# Altium schematic sheet Microcontroller.SchDoc
size A4; SheetNumber: 5; SheetTotal: 5
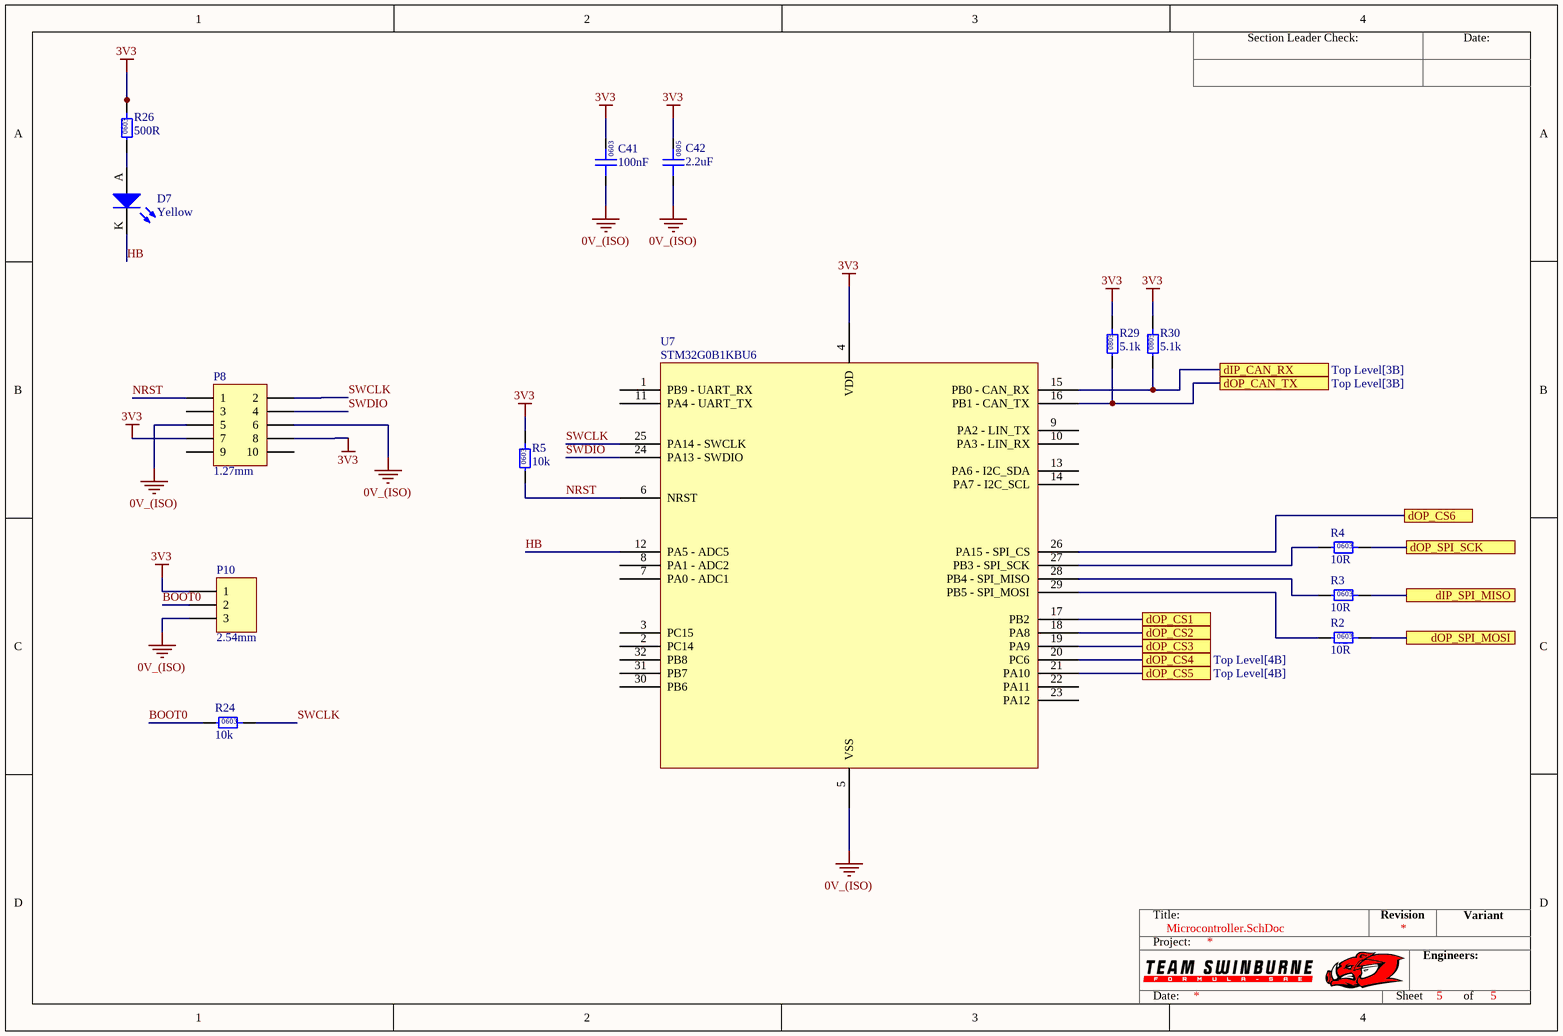
[diagram p0: Microcontroller.SchDoc]

## Parts
C41  100nF  [0603 Capacitor]
C42  2.2uF  [GCM21BR71H105KA03L-Footprint-1]
D7  Yellow  [0805 LED]
P8  1.27mm  [3221-10-0300-00]
P10  2.54mm  [TH 2.54mm Header 1x3]
R2  10R  [0603]
R3  10R  [0603]
R4  10R  [0603]
R5  10k  [0603]
R24  10k  [0603]
R26  500R  [0603]
R29  5.1k  [0805]
R30  5.1k  [0805]
U7  STM32G0B1KBU6  [ST-UFQFPN32]

## Ports
dIP_CAN_RX (see Top Level[3B]), dIP_SPI_MISO (see Top Level[4C], Temp Bank[1C]), dOP_CAN_TX (see Top Level[3B]), dOP_CS1 (see Top Level[4B]), dOP_CS2 (see Top Level[4B]), dOP_CS3 (see Top Level[4B]), dOP_CS4 (see Top Level[4B]), dOP_CS5 (see Top Level[4B]), dOP_CS6 (see Top Level[4B]), dOP_SPI_MOSI (see Top Level[4B], Temp Bank[1C]), dOP_SPI_SCK (see Top Level[4B])

## Nets
0V_(ISO): C41.1 C42.1 P8.5 P8.6 P10.3 U7.5(VSS)
3V3: C41.2 C42.2 P8.7 P8.8 P10.1 R5.2 R26.2 R29.2 R30.2 U7.4(VDD)
BOOT0: P10.2 R24.1
dIP_CAN_RX: R30.1 U7.15(PB0_-_CAN_RX) ; port dIP_CAN_RX
dIP_SPI_MISO: R3.2 ; port dIP_SPI_MISO
dOP_CAN_TX: R29.1 U7.16(PB1_-_CAN_TX) ; port dOP_CAN_TX
dOP_CS1: U7.17(PB2) ; port dOP_CS1
dOP_CS2: U7.18(PA8) ; port dOP_CS2
dOP_CS3: U7.19(PA9) ; port dOP_CS3
dOP_CS4: U7.20(PC6) ; port dOP_CS4
dOP_CS5: U7.21(PA10) ; port dOP_CS5
dOP_CS6: U7.26(PA15_-_SPI_CS) ; port dOP_CS6
dOP_SPI_MOSI: R2.2 ; port dOP_SPI_MOSI
dOP_SPI_SCK: R4.2 ; port dOP_SPI_SCK
HB: D7.K U7.12(PA5_-_ADC5)
NRST: P8.1 R5.1 U7.6(NRST)
SWCLK: P8.2 R24.2 U7.25(PA14_-_SWCLK)
SWDIO: P8.4 U7.24(PA13_-_SWDIO)
NetD7_A: D7.A R26.1
NetR2_1: R2.1 U7.29(PB5_-_SPI_MOSI)
NetR3_1: R3.1 U7.28(PB4_-_SPI_MISO)
NetR4_1: R4.1 U7.27(PB3_-_SPI_SCK)

Not connected (* = marked no-connect by the designer): P8 3 9 10; U7 1(PB9_-_UART_RX) 2(PC14) 3(PC15) 7(PA0_-_ADC1) 8(PA1_-_ADC2) 9(PA2_-_LIN_TX) 10(PA3_-_LIN_RX) 11(PA4_-_UART_TX) 13(PA6_-_I2C_SDA) 14(PA7_-_I2C_SCL) 22(PA11) 23(PA12) 30(PB6) 31(PB7) 32(PB8)

## Notes on the sheet
- Section Leader Check:
- Date:
- Title:
- Revision
- Variant
- Project:
- Engineers:
- Sheet
- of
- (in symbol CMP-102-000031-7) 0603
- (in symbol CMP-102-000032-2) 0805
- (in symbol RC0603FR-0710KL) 0603
- (in symbol RC0603FR-0710RL) 0603
- (in symbol RC0805FR075K1L) 0805
- (in symbol RT0603BRD07500RL) 0603

## Library data of the parts
C41 = CMP-102-000031-7: Ceramic Capacitor, Multilayer, Ceramic, 50V, 10% +Tol, 10% -Tol, X8L, -40/+15% TC, 0.1uF, Surface Mount, 0603; Part Number: GCM188L81H104KA57D; Material: X8L; Digikey Link: https://www.digikey.com.au/en/products/detail/murata-electronics/GCM188L81H104KA57D/2591908?s=N4IgTCBcDaIOIGECyBGAHGgMmlAJFADACwDSAggKwDsAIiALoC%2BQA; Rated Voltage: 50V; Tolerance: 10%; Value: 100nF
C42 = CMP-102-000032-2: Ceramic Capacitor, Multilayer, Ceramic, 25V, 10% +Tol, 10% -Tol, X7R, 15% TC, 2.2uF, Surface Mount, 0805; Part Number: GRM21BR71E225KE11L; Rated Voltage: 50V; Value: 2.2µF; Material: X7R; Tolerance: 10%; Digikey Link: https://www.digikey.com.au/en/products/detail/murata-electronics/GRM21BR71E225KE11L/6606096?s=N4IgTCBcDaIOICUCyYCMAhBB2VBRMYArANK6qoAyIAugL5A
D7 = SML-211YTT86: Yellow LED Indication - Discrete 1.75V 0805 (2012 Metric); Manufacturer: ROHM Semiconductor; Part Number: SML-211YTT86; Colour: Yellow; Digikey Part Number: 511-1293-1-ND
P8 = SMD 1.27mm Header 2x5 (3221-10-0300-00): Positions: 10; Angle: 0; Flange: No; Contact: NA; Part Number: SMD 1.27mm Header 2x5 (3221-10-0300-00); Pitch: 1.27mm; Row Spacing: 1.27mm
P10 = TH 2.54mm Header 1x3: Positions: 3; Angle: 0; Flange: No; Contact: NA; Part Number: TH 2.54mm Header 1x3; Pitch: 2.54mm; Row Spacing: 2.54mm
R2-R4 = RC0603FR-0710RL: Manufacturer: YAGEO; Tolerance: 0.01; Rated Power: 0.1W; Part Number: RC0603FR-0710RL; Value: 10R; Material: FR-07; Digikey Part Number: 311-10.0HRCT-ND
R5 R24 = RC0603FR-0710KL: Manufacturer: YAGEO; Tolerance: 0.01; Rated Power: 0.1W; Part Number: RC0603FR-0710KL; Value: 10k; Digikey Part Number: 311-10.0KHRCT-ND; Material: FR-07
R26 = RT0603BRD07500RL: Manufacturer: YAGEO; Tolerance: 0.01; Rated Power: 0.1W; Part Number: RT0603BRD07500RL; Value: 500R; Material: FR-07; Digikey Part Number: 13-RT0603BRD07500RL-ND
R29 R30 = RC0805FR075K1L: Manufacturer: YAGEO; Tolerance: 0.01; Rated Power: 0.125W; Part Number: RC0805FR075K1L; Value: 5.1k; Material: FR-07; Digikey Part Number: 311-5.10KCRCT-ND
U7 = CMP-029-000004-2: RISC Microcontroller, 32-Bit, FLASH, Cortex-M0+ CPU, 64MHz, CMOS